# Altium schematic sheet Power.SchDoc
size A4; SheetNumber: 1; SheetTotal: 4; SPICEModelCacheJPOIHVMT: <root> / <DocumentId>JPOIHVMT</DocumentId> / <CacheFrame Number="0"> / <Model Name="0805_150080gs75000" Kind="CKT"> / <Text>****** / .subckt 0805_150080GS75000  1  2 / D1 1 2 SMCW / .MODEL SMCW D / + IS=906.98E-12 / + N=4.4982 / + RS=1.5743 / + IKF=518.93E-9 / + CJO=1.0000E-12 / + M=.3333 / + VJ=.75 / + BV=5 / + IBV=10.00E-6 / + TT=5.0000E-9 / .ends</Text> / </Model> / </CacheFrame> / </root>
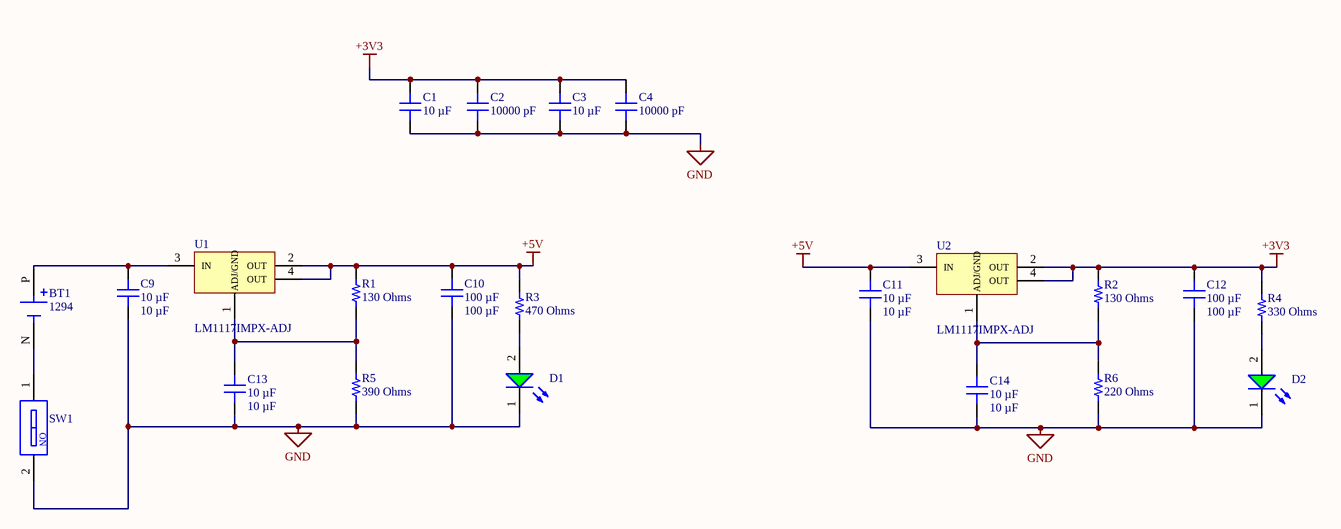
[diagram p0: Power.SchDoc]

## Parts
BT1  1294  [BAT_1294]
C1  10 µF  [CAP 0805_2012]
C2  10000 pF  [CAP 0805_2012]
C3  10 µF  [CAP 0805_2012]
C4  10000 pF  [CAP 0805_2012]
C9  10 µF  [CAP 0805_2012]
C10  100 µF  [CAP 0805_2012]
C11  10 µF  [CAP 0805_2012]
C12  100 µF  [CAP 0805_2012]
C13  10 µF  [CAP 0805_2012]
C14  10 µF  [CAP 0805_2012]
D1  Green, 3.2V, 140°  [WL-SMCW_0805_150080xx75000]  (value not drawn)
D2  Green, 3.2V, 140°  [WL-SMCW_0805_150080xx75000]  (value not drawn)
R1  130 Ohms  [RES 0805_2012]
R2  130 Ohms  [RES 0805_2012]
R3  470 Ohms  [RES 0805_2012]
R4  330 Ohms  [RES 0805_2012]
R5  390 Ohms  [RES 0805_2012]
R6  220 Ohms  [RES 0805_2012]
SW1  418121270801  [418121270801]  (value not drawn)
U1  LM1117IMPX-ADJ  [SOT-223-4 M]
U2  LM1117IMPX-ADJ  [SOT-223-4 M]

## Nets
+3V3: C1.1 C2.2 C3.1 C4.2 C12.2 R2.2 R4.2 U2.2(OUT) U2.4(OUT)
+5V: C10.2 C11.2 R1.2 R3.2 U1.2(OUT) U1.4(OUT) U2.3(IN)
GND: C1.2 C2.1 C3.2 C4.1 C9.1 C10.1 C11.1 C12.1 C13.1 C14.1 D1.1(K) D2.1(K) R5.1 R6.1 SW1.2
NetBT1_N: BT1.N(NEG) SW1.1
NetBT1_P: BT1.P(POS) C9.2 U1.3(IN)
NetC13_2: C13.2 R1.1 R5.2 U1.1(ADJ/GND)
NetC14_2: C14.2 R2.1 R6.2 U2.1(ADJ/GND)
NetD1_2: D1.2(A) R3.1
NetD2_2: D2.2(A) R4.1

## Notes on the sheet
- (in symbol 418121270801) ON

## Library data of the parts
BT1 = Bat-1294: 9V battery holder; Package: None; MP: 1294; Value: *; Availability: Unavailable; Price: None
C1 C3 = C0805C106K3PAC7800: CAP CER 10UF 25V X5R 0805; manufacturer: KEMET; Tolerance: ±10%; Part Number: C0805C106K3PAC7800; Value: 10 µF; Applications: Bypass, Decoupling; Capacitance: 10 µF; componentlink1description: Datasheet; componentlink1url: https://api.kemet.com/component-edge/download/datasheet/C0805C106K3PAC7800.pdf; componentlink2description: DigiKey Link; componentlink2url: https://www.digikey.com/en/products/detail/kemet/C0805C106K3PAC7800/5267604; Device Package: 0805 (2012 Metric); lastupdated: 9.02.2024 20:15:18; Lifecycle Status: Active; Minimum Order: 1; Mounting Type: Surface Mount, MLCC; Operating Temperature: -55°C ~ 85°C; Package / Case: 0805 (2012 Metric); packaging: TapeAndReel; partid: 18542; Part Status: Active; price: 0.03; series: SMD Comm X5R; Size / Dimension: 0.079" L x 0.049" W (2.00mm x 1.25mm); Supplier 1: DigiKey; Supplier Part Number 1: 399-11939-1-ND; Temperature Coefficient: X5R; Thickness (Max): 0.057" (1.45mm); Voltage - Rated: 25V
C2 C4 = C0805C103J3GECAUTO: CAP CER 0805 10NF 25V C0G 5%; manufacturer: KEMET; Temperature Coefficient: C0G, NP0; Part Number: C0805C103J3GECAUTO; Value: 10000 pF; Applications: Automotive, ESD Protection; Capacitance: 10000 pF; componentlink1description: Datasheet; componentlink1url: https://api.kemet.com/component-edge/download/datasheet/C0805C103J3GECAUTO.pdf; componentlink2description: DigiKey Link; componentlink2url: https://www.digikey.com/en/products/detail/kemet/C0805C103J3GECAUTO/8647361; Device Package: 0805 (2012 Metric); Features: Low ESL; lastupdated: 9.02.2024 20:15:09; Lifecycle Status: Active; Minimum Order: 1; Mounting Type: Surface Mount, MLCC; Operating Temperature: -55°C ~ 125°C; Package / Case: 0805 (2012 Metric); packaging: TapeAndReel; partid: 32681; Part Status: Active; price: 0.05; Ratings: AEC-Q200; series: ESD SMD Auto C0G; Size / Dimension: 0.079" L x 0.049" W (2.00mm x 1.25mm); Supplier 1: DigiKey; Supplier Part Number 1: 399-C0805C103J3GECAUTOCT-ND; Thickness (Max): 0.039" (1.00mm); Tolerance: ±5%; Voltage - Rated: 25V
C9 C11 C13 C14 = CL21Y106KPQVPNE: CAP CER 10UF 10V X7S 0805; Part Number: CL21Y106KPQVPNE; Value: 10 µF
C10 C12 = PMK212BBJ107MG-T: CAP CER 100UF 2.5V X5R 0805; Part Number: PMK212BBJ107MG-T; Value: 100 µF
D1 D2 = 150080GS75000: WL-SMCW Mono-color Chip LED Waterclear, size 0805, Green, 3.2V, 140°; Manufacturer: Wurth Elektronik; Case/Size Code: 0805; Chip Technology: InGaN; Dominant Wavelength: 525nm; Luminous Intensity: 450mcd; Peak Wavelength: 515nm; Manufacturer Part Number: 150080GS75000; Category: Signal LEDs; Match Code: WL-SMCW; ComponentLink1Description: Website Link; ComponentLink1URL: https://www.we-online.com/redexpert/article/150080GS75000?ad; ComponentLink2Description: Datasheet Link; ComponentLink2URL: https://www.we-online.com/redexpert/spec/150080GS75000?ad; Mount: Surface Mount; Operating Temperature Max: 85°C; Operating Temperature Min: -40°C; Packaging: Tape and Reel; Length: 2mm; Width: 1.25mm; Height: 0.7mm; Emitting Color: Green; Forward Voltage: 3.2V; Viewing Angle: 140°
R1 R2 = 3-2176091-5: RES SMD 130 OHM 0.1% 1/4W 0805; Manufacturer: TE Connectivity Passive Product; Power (Watts): 0.25W, 1/4W; Temperature Coefficient: ±25ppm/°C; Part Number: 3-2176091-5; Value: 130 Ohms; ComponentLink1Description: Datasheet; ComponentLink1URL: https://www.te.com/commerce/DocumentDelivery/DDEController?Action=srchrtrv&DocNm=1773272&DocType=DS&DocLang=English; ComponentLink2Description: DigiKey Link; ComponentLink2URL: https://www.digikey.com/en/products/detail/te-connectivity-passive-product/3-2176091-5/4033926; Composition: Thin Film; Device Package: 0805 (2012 Metric); Height - Seated (Max): 0.026" (0.65mm); LastUpdated: 8.02.2024 21:00:46; Lifecycle Status: Active; Minimum Order: 1; Number of Terminations: 2; Operating Temperature: -55°C ~ 155°C; Package / Case: 0805 (2012 Metric); Packaging: TapeAndReel; PartId: 49761; Part Status: Active; Price: 0.14; Resistance: 130 Ohms; Series: RP73P, Holsworthy; Size / Dimension: 0.079" L x 0.049" W (2.00mm x 1.25mm); Supplier 1: DigiKey; Supplier Part Number 1: A110458CT-ND; Supplier Device Package: 0805; Tolerance: ±0.1%
R3 = 3430A2F470RTDF: 3430 A2 1% 470R 100PPM 1K RL; Manufacturer: TE Connectivity Passive Product; Power (Watts): 1W; Temperature Coefficient: ±100ppm/°C; Part Number: 3430A2F470RTDF; Value: 470 Ohms; ComponentLink2Description: DigiKey Link; ComponentLink2URL: https://www.digikey.com/en/products/detail/te-connectivity-passive-product/3430A2F470RTDF/17763718; Composition: Thick Film; Device Package: 0805 (2012 Metric); Features: Automotive AEC-Q200; Height - Seated (Max): 0.026" (0.65mm); LastUpdated: 8.02.2024 21:00:03; Lifecycle Status: Active; Minimum Order: 1; Number of Terminations: 2; Operating Temperature: -55°C ~ 155°C; Package / Case: 0805 (2012 Metric); Packaging: TapeAndReel; PartId: 77780; Part Status: Active; Price: 0.02; Ratings: AEC-Q200; Resistance: 470 Ohms; Series: 3430; Size / Dimension: 0.049" L x 0.079" W (1.25mm x 2.00mm); Supplier 1: DigiKey; Supplier Part Number 1: 1712-3430A2F470RTDFCT-ND; Supplier Device Package: 0508; Tolerance: ±1%
R4 = 3430A2F330RTDF: 3430 A2 1% 330R 100PPM 1K RL; Manufacturer: TE Connectivity Passive Product; Power (Watts): 1W; Temperature Coefficient: ±100ppm/°C; Part Number: 3430A2F330RTDF; Value: 330 Ohms; ComponentLink2Description: DigiKey Link; ComponentLink2URL: https://www.digikey.com/en/products/detail/te-connectivity-passive-product/3430A2F330RTDF/17762827; Composition: Thick Film; Device Package: 0805 (2012 Metric); Features: Automotive AEC-Q200; Height - Seated (Max): 0.026" (0.65mm); LastUpdated: 8.02.2024 21:00:04; Lifecycle Status: Active; Minimum Order: 1; Number of Terminations: 2; Operating Temperature: -55°C ~ 155°C; Package / Case: 0805 (2012 Metric); Packaging: TapeAndReel; PartId: 77524; Part Status: Active; Price: 0.02; Ratings: AEC-Q200; Resistance: 330 Ohms; Series: 3430; Size / Dimension: 0.049" L x 0.079" W (1.25mm x 2.00mm); Supplier 1: DigiKey; Supplier Part Number 1: 1712-3430A2F330RTDFCT-ND; Supplier Device Package: 0508; Tolerance: ±1%
R5 = 3430A2F390RTDF: 3430 A2 1% 390R 100PPM 1K RL; Manufacturer: TE Connectivity Passive Product; Power (Watts): 1W; Temperature Coefficient: ±100ppm/°C; Part Number: 3430A2F390RTDF; Value: 390 Ohms; ComponentLink2Description: DigiKey Link; ComponentLink2URL: https://www.digikey.com/en/products/detail/te-connectivity-passive-product/3430A2F390RTDF/17763108; Composition: Thick Film; Device Package: 0805 (2012 Metric); Features: Automotive AEC-Q200; Height - Seated (Max): 0.026" (0.65mm); LastUpdated: 8.02.2024 21:00:03; Lifecycle Status: Active; Minimum Order: 1; Number of Terminations: 2; Operating Temperature: -55°C ~ 155°C; Package / Case: 0805 (2012 Metric); Packaging: TapeAndReel; PartId: 77771; Part Status: Active; Price: 0.02; Ratings: AEC-Q200; Resistance: 390 Ohms; Series: 3430; Size / Dimension: 0.049" L x 0.079" W (1.25mm x 2.00mm); Supplier 1: DigiKey; Supplier Part Number 1: 1712-3430A2F390RTDFCT-ND; Supplier Device Package: 0508; Tolerance: ±1%
R6 = CPF0805B220RE1: RES SMD 220 OHM 0.1% 1/10W 0805; Manufacturer: TE Connectivity Passive Product; Power (Watts): 0.1W, 1/10W; Temperature Coefficient: ±25ppm/°C; Part Number: CPF0805B220RE1; Value: 220 Ohms; ComponentLink1Description: Datasheet; ComponentLink1URL: https://www.te.com/commerce/DocumentDelivery/DDEController?Action=srchrtrv&DocNm=1773200&DocType=DS&DocLang=English; ComponentLink2Description: DigiKey Link; ComponentLink2URL: https://www.digikey.com/en/products/detail/te-connectivity-passive-product/CPF0805B220RE1/2382016; Composition: Thin Film; Device Package: 0805 (2012 Metric); Height - Seated (Max): 0.026" (0.65mm); LastUpdated: 8.02.2024 21:02:21; Lifecycle Status: Active; Minimum Order: 1; Number of Terminations: 2; Operating Temperature: -55°C ~ 155°C; Package / Case: 0805 (2012 Metric); Packaging: TapeAndReel; PartId: 31853; Part Status: Active; Price: 0.12; Resistance: 220 Ohms; Series: CPF, Neohm; Size / Dimension: 0.079" L x 0.049" W (2.00mm x 1.25mm); Supplier 1: DigiKey; Supplier Part Number 1: A103177CT-ND; Supplier Device Package: 0805; Tolerance: ±0.1%
SW1 = 418121270801: WS-DISV Small Compact SMT Dip Switch, Raised Actuator, pitch 2.54mm, 1p; Manufacturer: Wurth Elektronik; Actuator Type: Raise Type; Operation Force: 600g; Number of Poles: 1; Rated Current Non-Switching: 100mA; Rated Current Switching: 25mA; Rated Voltage Non-Switching: 50VDC; Rated Voltage Switching: 24VDC; Manufacturer Part Number: 418121270801; Category: Dip Switches; Match Code: WS-DISV; ComponentLink1Description: Website Link; ComponentLink1URL: https://www.we-online.com/redexpert/article/418121270801?ad; ComponentLink2Description: Datasheet Link; ComponentLink2URL: https://www.we-online.com/redexpert/spec/418121270801?ad; Mount: Surface Mount; Operating Temperature Max: 85°C; Operating Temperature Min: -40°C; Packaging: Tape and Reel; Contact Material: Copper Alloy; Contact Plating: Gold; Pitch: 2.54mm
U1 U2 = LM1117IMPX-ADJ: LDO Regulator Pos 3.3V 0.8A 4-Pin(3+Tab) SOT-223 T/R; Manufacturer: Texas Instruments; Manufacturer Part Number: LM1117IMPX-3.3; Output Current: 800mA; Dropout Voltage: 1.2V; Quiescent Current: 15mA; Number of Outputs: 1; Max Input Voltage: 15V; Polarity: Positive; Accuracy: 1%; Output Type: Fixed; RoHS: No; Category: Voltage Regulators - Linear; Mount: Surface Mount; Case/Package: SOT-223; Number of Pins: 4; Min Operating Temperature: -40°C; Max Operating Temperature: 125°C; Output Voltage: 3.3V; Packaging: Tape and Reel; Max Output Current: 800mA; Output Voltage Accuracy: 1%; Package Quantity: 2000; Number of Regulators: 1; Min Current Limit: 800mA; Lead Free: Contains Lead; ComponentLink1URL: https://datasheet.ciiva.com/6588/lm1117-n-6588632.pdf?src-supplier=Digi-Key; ComponentLink1Description: https://datasheet.ciiva.com/6588/lm1117-n-6588632.pdf?src-supplier=Digi-Key; ComponentLink2URL: https://datasheet.ciiva.com/6588/lm1117-n-6588636.pdf?src-supplier=Digi-Key; ComponentLink2Description: https://datasheet.ciiva.com/6588/lm1117-n-6588636.pdf?src-supplier=Digi-Key; ComponentLink3URL: https://datasheet.ciiva.com/6588/lm1117-n-6588639.pdf?src-supplier=Digi-Key; ComponentLink3Description: https://datasheet.ciiva.com/6588/lm1117-n-6588639.pdf?src-supplier=Digi-Key; Supplier 1: Mouser; Supplier Part Number 1: 926-M1117IMPXADJNOPB